# Altium schematic sheet Hierarchical Design.SchDoc
size Letter; DrawnBy: Adrianna Ascalon; Organization: UW Robotics; Address1: 200 University Avenue; Address2: Waterloo; Address3: Ontario; Address4: Canada N2L 3G6
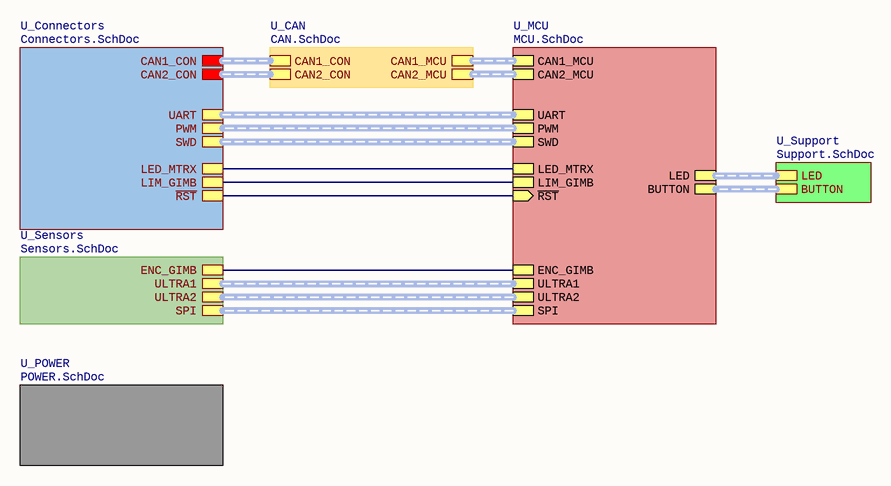
[diagram p0: Hierarchical Design.SchDoc]

## Sub-sheets
U_CAN = CAN.SchDoc: CAN1_CON (harness CAN1), CAN2_CON (harness CAN2), CAN2_MCU (harness CAN2_MCU), CAN1_MCU (harness CAN1_MCU)
U_Connectors = Connectors.SchDoc: ~{RST}, LIM_GIMB, LED_MTRX, CAN1_CON (harness CAN1), CAN2_CON (harness CAN2), UART (harness UART), PWM (harness PWM), SWD (harness SWD)
U_MCU = MCU.SchDoc: ~{RST}, ENC_GIMB, LIM_GIMB, UART (harness UART), ULTRA1 (harness ULTRA1), ULTRA2 (harness ULTRA2), CAN1_MCU (harness CAN1_MCU), CAN2_MCU (harness CAN2_MCU), LED (harness LED), SPI (harness SPI), SWD (harness SWD), BUTTON (harness BUTTON), PWM (harness PWM), LED_MTRX
U_POWER = POWER.SchDoc: no entries
U_Sensors = Sensors.SchDoc: ENC_GIMB, ULTRA2 (harness ULTRA2), ULTRA1 (harness ULTRA1), SPI (harness SPI)
U_Support = Support.SchDoc: LED (harness LED), BUTTON (harness BUTTON)

## Nets
(unnamed): sheet U_Connectors/~{RST}, sheet U_MCU/~{RST}
(unnamed): sheet U_Connectors/LIM_GIMB, sheet U_MCU/LIM_GIMB
(unnamed): sheet U_Connectors/LED_MTRX, sheet U_MCU/LED_MTRX
(unnamed): sheet U_MCU/ENC_GIMB, sheet U_Sensors/ENC_GIMB

## Buses and harness runs
harness sheet U_CAN/CAN1_CON = sheet U_Connectors/CAN1_CON
harness sheet U_CAN/CAN1_MCU = sheet U_MCU/CAN1_MCU
harness sheet U_CAN/CAN2_CON = sheet U_Connectors/CAN2_CON
harness sheet U_CAN/CAN2_MCU = sheet U_MCU/CAN2_MCU
harness sheet U_Connectors/PWM = sheet U_MCU/PWM
harness sheet U_Connectors/SWD = sheet U_MCU/SWD
harness sheet U_Connectors/UART = sheet U_MCU/UART
harness sheet U_MCU/BUTTON = sheet U_Support/BUTTON
harness sheet U_MCU/LED = sheet U_Support/LED
harness sheet U_MCU/SPI = sheet U_Sensors/SPI
harness sheet U_MCU/ULTRA1 = sheet U_Sensors/ULTRA1
harness sheet U_MCU/ULTRA2 = sheet U_Sensors/ULTRA2

## Notes on the sheet
- Title
- Size:
- Date:
- Letter
- Drawn By:
- Sheet
- of
- File: